# Altium schematic sheet alimentacao.SchDoc
size A4; SheetNumber: 2; SheetTotal: 3
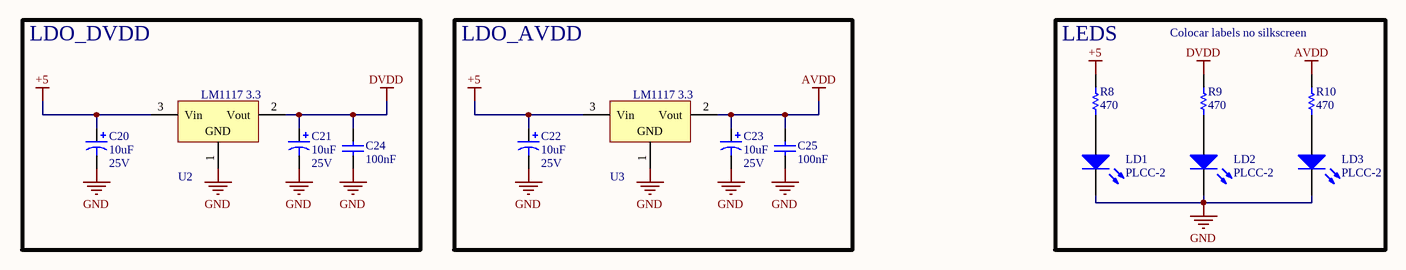
[diagram p0: alimentacao.SchDoc]

## Parts
C20  value 10uF  Voltage: 25V  [CAP2312]  (hidden comment: CAP SMD TAN 10UF 25V 2312)
C21  value 10uF  Voltage: 25V  [CAP2312]  (hidden comment: CAP SMD TAN 10UF 25V 2312)
C22  value 10uF  Voltage: 25V  [CAP2312]  (hidden comment: CAP SMD TAN 10UF 25V 2312)
C23  value 10uF  Voltage: 25V  [CAP2312]  (hidden comment: CAP SMD TAN 10UF 25V 2312)
C24  value 100nF  [CAP0805OK]  (hidden comment: CAP SMD CER 100NF 25V 0805)
C25  value 100nF  [CAP0805OK]  (hidden comment: CAP SMD CER 100NF 25V 0805)
LD1  PLCC-2  [PLCC-2]
LD2  PLCC-2  [PLCC-2]
LD3  PLCC-2  [PLCC-2]
R8  value 470  [res0805ok]  (hidden comment: RES SMD 1K 1% 0805)
R9  value 470  [res0805ok]  (hidden comment: RES SMD 1K 1% 0805)
R10  value 470  [res0805ok]  (hidden comment: RES SMD 1K 1% 0805)
U2  LM1117  [TO252-3]  (value not drawn)
U3  LM1117  [TO252-3]  (value not drawn)

## Blocks framed on the sheet
LDO_DVDD: C20 C21 C24 U2
LDO_AVDD: C22 C23 C25 U3
LEDS: LD1-LD3 R8-R10

## Nets
+5: C20.1 C22.1 R8.2 U2.3(Vin) U3.3(Vin)
AVDD: C23.1 C25.1 R10.2 U3.2(Vout)
DVDD: C21.1 C24.1 R9.2 U2.2(Vout)
GND: C20.2 C21.2 C22.2 C23.2 C24.2 C25.2 LD1.2(K) LD2.2(K) LD3.2(K) U2.1(ADJ) U3.1(ADJ)
NetLD1_1: LD1.1(A) R8.1
NetLD2_1: LD2.1(A) R9.1
NetLD3_1: LD3.1(A) R10.1

## Notes on the sheet
- Colocar labels no silkscreen
- (in symbol IC SMD REG LM1117 TO252) LM1117 3.3; GND

## Library data of the parts
C20-C23 = CAP SMD TAN 10UF 25V 2312: COD. CRISTOFOLI: EMP.00040; Tolerance: 20%; List: CAP TANT 10UF 25V 20% 2312 / 293D106X0025C2TE3 / Vishay; Type: TANTALUM
C24 C25 = CAP SMD CER 100NF 25V 0805: COD. CRISTOFOLI: EMP.00094; Tolerance: 10%; List: CAP CER 0.1UF 25V 10% X7R 0805/CGJ4J2X7R1E104K125AA/TDK; Type: CERAMIC; Voltage: 25V
LD1-LD3 = LED branco /67-21S/KK5C-H6565N32P02833Z6/2T(EMM)/Everlight: COD. CRISTOFOLI: EMP.00388; List: LED branco /67-21S/KK5C-H6565N32P02833Z6/2T(EMM)/Everlight
R8-R10 = RES SMD 1K 1% 0805: COD. CRISTOFOLI: EMP.50098; List: RES SMD 1K 1% 0805; Tolerance: 1%
U2 U3 = IC SMD REG LM1117 TO252: 800mA Low-Dropout Linear Regulator; Manufacturer: Texas Instruments; COD. CRISTOFOLI: EMP.50030; Voltage: 1.8 A 5V; List: IC SMD REG LM1117 TO252; Value: LM1117